# Altium schematic sheet Bank.SchDoc
size A3
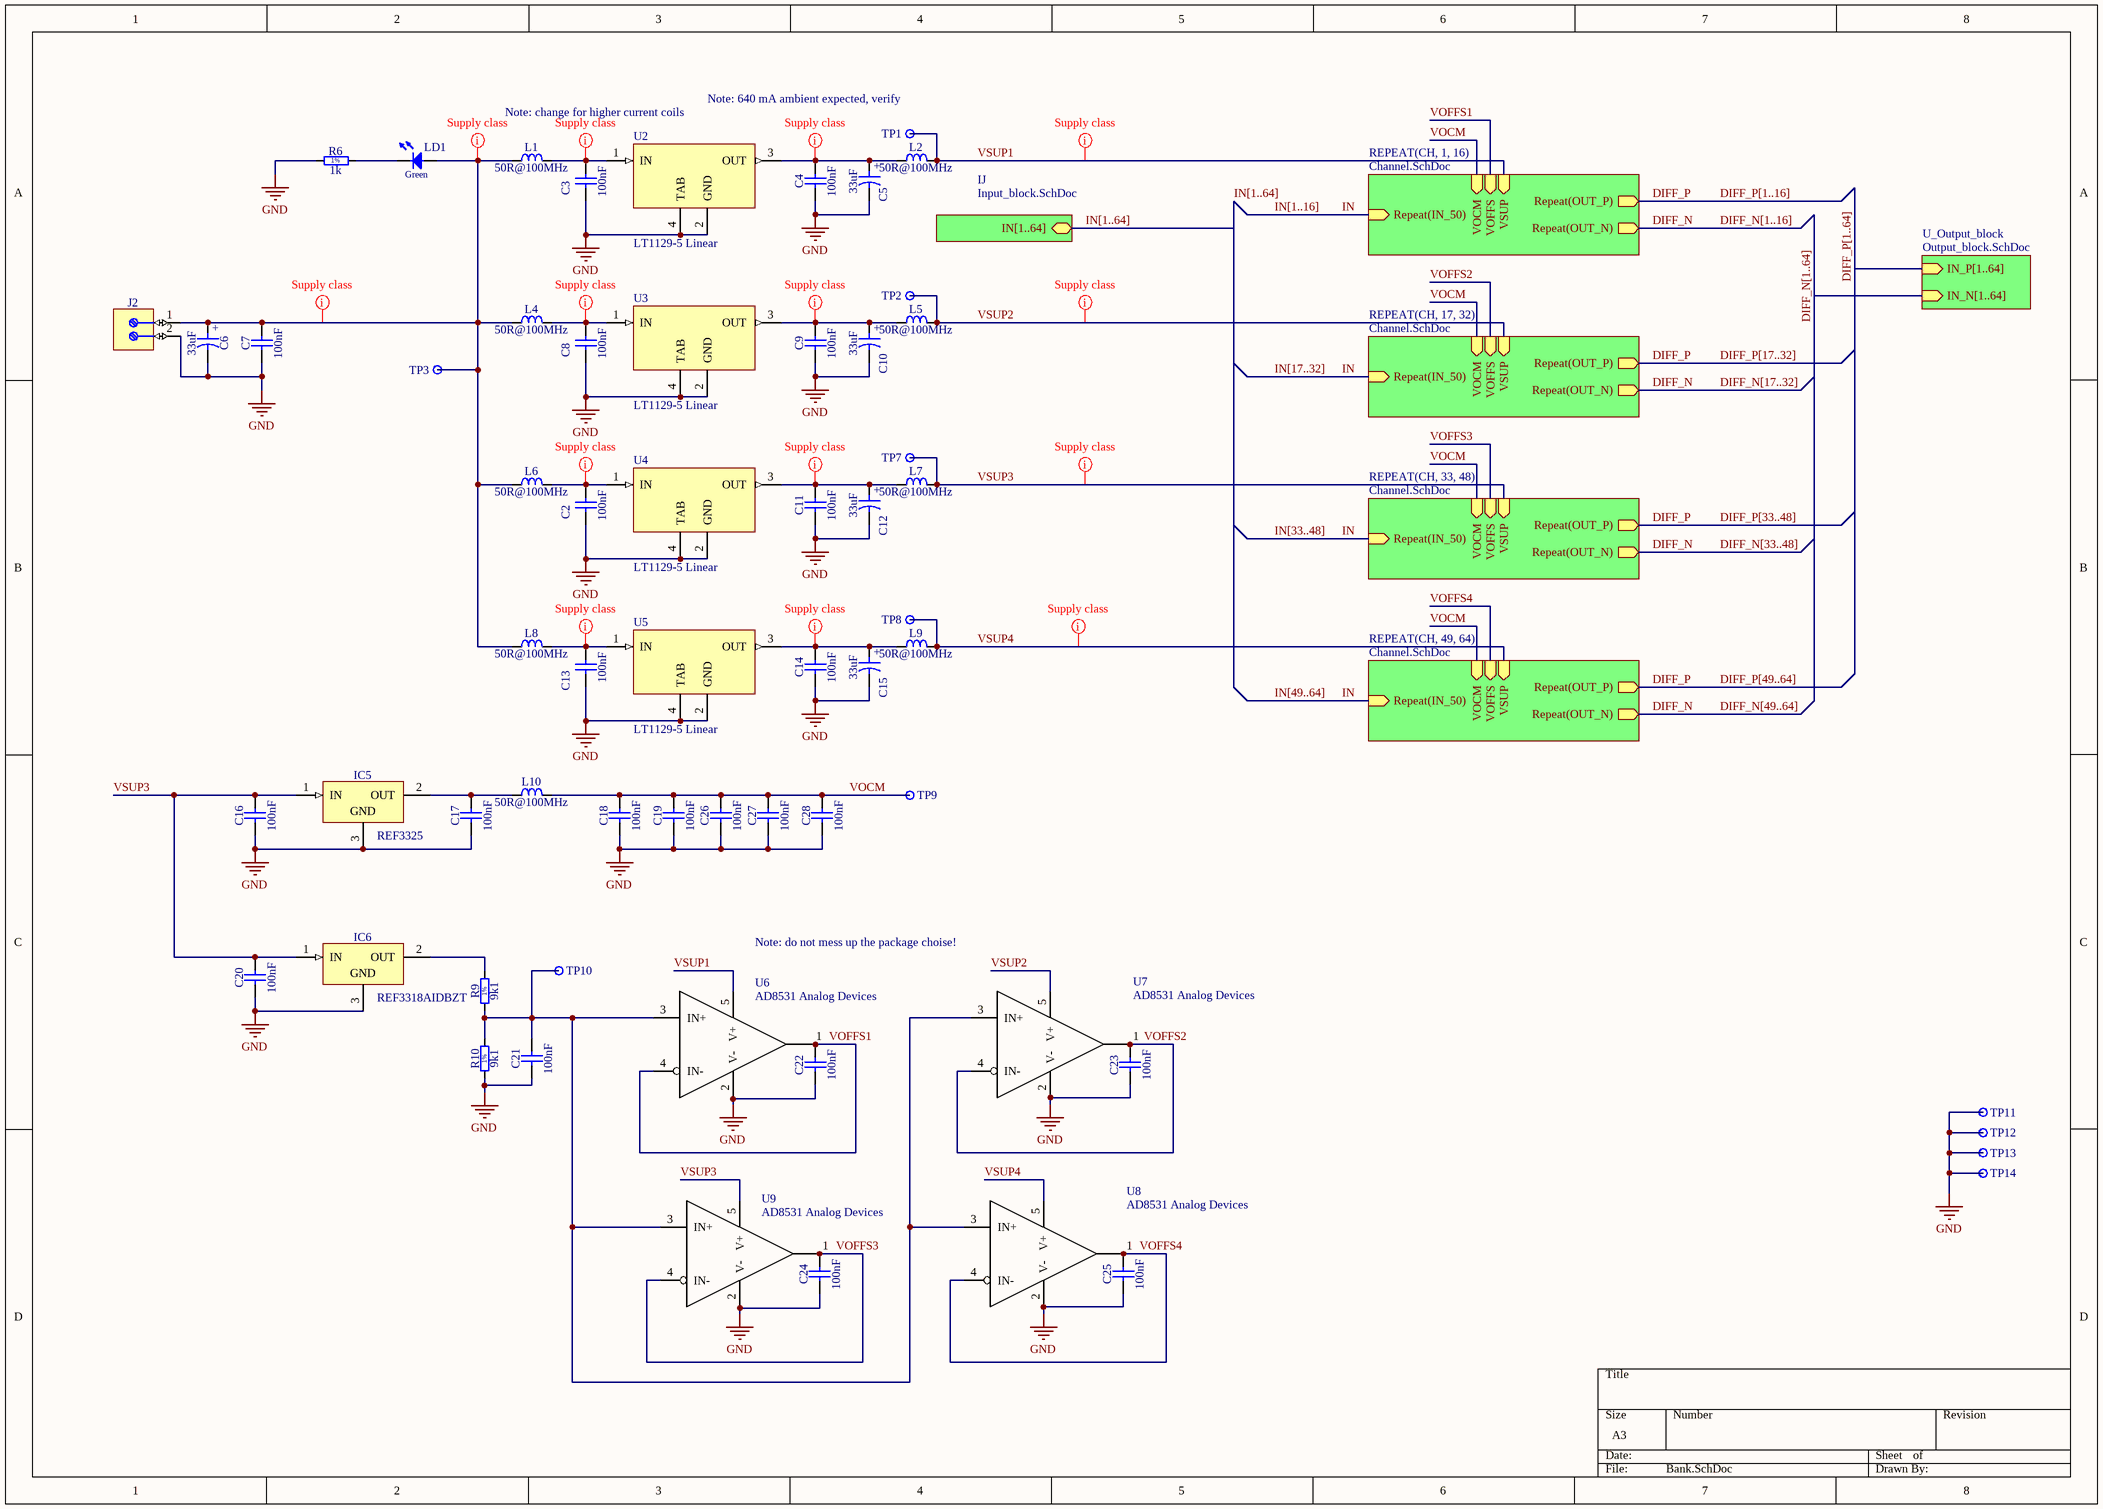
[diagram p0: Bank.SchDoc]

## Parts
C2  100nF  [CAPC2012X135N]
C3  100nF  [CAPC2012X135N]
C4  100nF  [CAPC2012X135N]
C5  33uF  [CAPAE660X540N]
C6  33uF  [CAPAE660X540N]
C7  100nF  [CAPC2012X135N]
C8  100nF  [CAPC2012X135N]
C9  100nF  [CAPC2012X135N]
C10  33uF  [CAPAE660X540N]
C11  100nF  [CAPC2012X135N]
C12  33uF  [CAPAE660X540N]
C13  100nF  [CAPC2012X135N]
C14  100nF  [CAPC2012X135N]
C15  33uF  [CAPAE660X540N]
C16  100nF  [CAPC2012X135N]
C17  100nF  [CAPC2012X135N]
C18  100nF  [CAPC2012X135N]
C19  100nF  [CAPC2012X135N]
C20  100nF  [CAPC2012X135N]
C21  100nF  [CAPC2012X135N]
C22  100nF  [CAPC2012X135N]
C23  100nF  [CAPC2012X135N]
C24  100nF  [CAPC2012X135N]
C25  100nF  [CAPC2012X135N]
C26  100nF  [CAPC2012X135N]
C27  100nF  [CAPC2012X135N]
C28  100nF  [CAPC2012X135N]
IC5  REF3325  [SOT95P237X112-3N]
IC6  REF3318AIDBZT  [SOT95P237X112-3N]
J2  Terminal  [WIELAND_25.161.0253.0]  (value not drawn)
L1  50R@100MHz  [IND_MURATA_BLM31PG]
L2  50R@100MHz  [IND_MURATA_BLM31PG]
L4  50R@100MHz  [IND_MURATA_BLM31PG]
L5  50R@100MHz  [IND_MURATA_BLM31PG]
L6  50R@100MHz  [IND_MURATA_BLM31PG]
L7  50R@100MHz  [IND_MURATA_BLM31PG]
L8  50R@100MHz  [IND_MURATA_BLM31PG]
L9  50R@100MHz  [IND_MURATA_BLM31PG]
L10  50R@100MHz  [IND_MURATA_BLM31PG]
LD1  Green  [LED_OSRAM_LGR971]  (value not drawn)
R6  1k  [RESC2012X60N]
R9  9k1  [RESC2012X60N]
R10  9k1  [RESC2012X60N]
TP1  Test Point  [VERO_20-313145]  (value not drawn)
TP2  Test Point  [VERO_20-313145]  (value not drawn)
TP3  Test Point  [VERO_20-313145]  (value not drawn)
TP7  Test Point  [VERO_20-313145]  (value not drawn)
TP8  Test Point  [VERO_20-313145]  (value not drawn)
TP9  Test Point  [VERO_20-313145]  (value not drawn)
TP10  Test Point  [VERO_20-313145]  (value not drawn)
TP11  Test Point  [VERO_20-313145]  (value not drawn)
TP12  Test Point  [VERO_20-313145]  (value not drawn)
TP13  Test Point  [VERO_20-313145]  (value not drawn)
TP14  Test Point  [VERO_20-313145]  (value not drawn)
U2  LT1129-5 Linear  [SOT230P700X175-4N]
U3  LT1129-5 Linear  [SOT230P700X175-4N]
U4  LT1129-5 Linear  [SOT230P700X175-4N]
U5  LT1129-5 Linear  [SOT230P700X175-4N]
U6  AD8531 Analog Devices  [SOT95P285X145-5N]
U7  AD8531 Analog Devices  [SOT95P285X145-5N]
U8  AD8531 Analog Devices  [SOT95P285X145-5N]
U9  AD8531 Analog Devices  [SOT95P285X145-5N]

## Sub-sheets
IJ = Input_block.SchDoc: IN[1..64] (bidir)
REPEAT(CH, 1, 16) = Channel.SchDoc: Repeat(OUT_N) (out), Repeat(OUT_P) (out), VSUP (in), Repeat(IN_50) (in), VOFFS (in), VOCM (in)
REPEAT(CH, 17, 32) = Channel.SchDoc: Repeat(OUT_N) (out), Repeat(OUT_P) (out), VSUP (in), Repeat(IN_50) (in), VOCM (in), VOFFS (in)
REPEAT(CH, 33, 48) = Channel.SchDoc: Repeat(OUT_N) (out), Repeat(OUT_P) (out), VSUP (in), Repeat(IN_50) (in), VOCM (in), VOFFS (in)
REPEAT(CH, 49, 64) = Channel.SchDoc: Repeat(OUT_N) (out), Repeat(OUT_P) (out), VSUP (in), Repeat(IN_50) (in), VOCM (in), VOFFS (in)
U_Output_block = Output_block.SchDoc: IN_P[1..64] (in), IN_N[1..64] (in)

## Nets
GND: C2.1 C3.1 C4.1 C5.2 C6.2 C7.1 C8.1 C9.1 C10.2 C11.1 C12.2 C13.1 C14.1 C15.2 C16.1 C17.1 C18.1 C19.1 C20.1 C21.1 C22.1 C23.1 C24.1 C25.1 C26.1 C27.1 C28.1 IC5.3(GND) IC6.3(GND) J2.2 R6.1 R10.1 TP11.1 TP12.1 TP13.1 TP14.1 U2.2(GND) U2.4(TAB) U3.2(GND) U3.4(TAB) U4.2(GND) U4.4(TAB) U5.2(GND) U5.4(TAB) U6.2(V-) U7.2(V-) U8.2(V-) U9.2(V-)
DIFF_N: sheet REPEAT(CH, 1, 16)/Repeat(OUT_N), sheet REPEAT(CH, 17, 32)/Repeat(OUT_N), sheet REPEAT(CH, 33, 48)/Repeat(OUT_N), sheet REPEAT(CH, 49, 64)/Repeat(OUT_N)
DIFF_P: sheet REPEAT(CH, 1, 16)/Repeat(OUT_P), sheet REPEAT(CH, 17, 32)/Repeat(OUT_P), sheet REPEAT(CH, 33, 48)/Repeat(OUT_P), sheet REPEAT(CH, 49, 64)/Repeat(OUT_P)
IN: sheet REPEAT(CH, 1, 16)/Repeat(IN_50), sheet REPEAT(CH, 17, 32)/Repeat(IN_50), sheet REPEAT(CH, 33, 48)/Repeat(IN_50), sheet REPEAT(CH, 49, 64)/Repeat(IN_50)
VOCM: C18.2 C19.2 C26.2 C27.2 C28.2 L10.2 TP9.1 ; sheet REPEAT(CH, 1, 16)/VOCM, sheet REPEAT(CH, 17, 32)/VOCM, sheet REPEAT(CH, 33, 48)/VOCM, sheet REPEAT(CH, 49, 64)/VOCM
VOFFS1: C22.2 U6.1(OUT+) U6.4(IN-) ; sheet REPEAT(CH, 1, 16)/VOFFS
VOFFS2: C23.2 U7.1(OUT+) U7.4(IN-) ; sheet REPEAT(CH, 17, 32)/VOFFS
VOFFS3: C24.2 U9.1(OUT+) U9.4(IN-) ; sheet REPEAT(CH, 33, 48)/VOFFS
VOFFS4: C25.2 U8.1(OUT+) U8.4(IN-) ; sheet REPEAT(CH, 49, 64)/VOFFS
VSUP1: L2.2 TP1.1 U6.5(V+) ; sheet REPEAT(CH, 1, 16)/VSUP
VSUP2: L5.2 TP2.1 U7.5(V+) ; sheet REPEAT(CH, 17, 32)/VSUP
VSUP3: C16.2 C20.2 IC5.1(IN) IC6.1(IN) L7.2 TP7.1 U9.5(V+) ; sheet REPEAT(CH, 33, 48)/VSUP
VSUP4: L9.2 TP8.1 U8.5(V+) ; sheet REPEAT(CH, 49, 64)/VSUP
NetC2_2: C2.2 L6.2 U4.1(IN)
NetC3_2: C3.2 L1.2 U2.1(IN)
NetC4_2: C4.2 C5.1 L2.1 U2.3(OUT)
NetC6_1: C6.1 C7.2 J2.1 L1.1 L4.1 L6.1 L8.1 LD1.2(A) TP3.1
NetC8_2: C8.2 L4.2 U3.1(IN)
NetC9_2: C9.2 C10.1 L5.1 U3.3(OUT)
NetC11_2: C11.2 C12.1 L7.1 U4.3(OUT)
NetC13_2: C13.2 L8.2 U5.1(IN)
NetC14_2: C14.2 C15.1 L9.1 U5.3(OUT)
NetC17_2: C17.2 IC5.2(OUT) L10.1
NetC21_2: C21.2 R9.1 R10.2 TP10.1 U6.3(IN+) U7.3(IN+) U8.3(IN+) U9.3(IN+)
NetIC6_2: IC6.2(OUT) R9.2
NetLD1_1: LD1.1(C) R6.2

## Buses and harness runs
bus DIFF_N[1..16]
bus DIFF_N[1..64] = sheet U_Output_block/IN_N[1..64]
bus DIFF_N[17..32]
bus DIFF_N[33..48]
bus DIFF_N[49..64]
bus DIFF_P[1..16]
bus DIFF_P[1..64] = sheet U_Output_block/IN_P[1..64]
bus DIFF_P[17..32]
bus DIFF_P[33..48]
bus DIFF_P[49..64]
bus IN[1..16]
bus IN[1..64] = sheet IJ/IN[1..64]
bus IN[17..32]
bus IN[33..48]
bus IN[49..64]

## Layout directives
net class Supply: NetC2_2, NetC3_2, NetC4_2, NetC6_1, NetC8_2, NetC9_2, NetC11_2, NetC13_2, NetC14_2, VSUP1, VSUP2, VSUP3, VSUP4

## Notes on the sheet
- (near TP1) Note: 640 mA ambient expected, verify
- Note: change for higher current coils
- Note: do not mess up the package choise!
- (in symbol CAE660-540_33UF_25V_20%) +
- (in symbol R0805_1K_1%_0.125W_100PPM) 1%
- (in symbol R0805_9K1_1%_0.125W_100PPM) 1%

## Library data of the parts
C2-C4 C7-C9 C11 C13 C14 C16-C28 = CC0805_100NF_50V_10%_X7R: Non-polarised capacitor; Part Description: SMD Multilayer Chip Ceramic Capacitor; Manufacturer: GENERIC; Manufacturer1 Part Number: C2012X7R1H104K085AA; Voltage: 50V; TC: X7R; Tolerance: ±10%; Part Number: CC0805_100NF_50V_10%_X7R; Component Kind: Standard; Component Type: Standard; Pin Count: 2; Value: 100nF; Status: Preferred; Manufacturer Part Number: CC0805_100NF_50V_10%_X7R; Case: 0805; Mounted: Yes; Socket: No; SMD: Yes; Sense: No; Manufacturer1 Example: TDK; Manufacturer1 ComponentHeight: 1mm; HelpURL: \\cern.ch\dfs\Applications\Altium\Datasheets\CC0805_X7R_TDK_C.pdf; Author: CERN DEM JLC; CreateDate: 03.12.2007; LatestRevisionDate: 22.04.2015
C5 C6 C10 C12 C15 = CAE660-540_33UF_25V_20%: Polarised capacitor; Part Description: Aluminum Electrolytic SMT Capacitor; Manufacturer: PANASONIC; Manufacturer Part Number: EEEFK1E330AP; Voltage: 25V; Tolerance: ±20%; Part Number: CAE660-540_33UF_25V_20%; Component Kind: Standard; Component Type: Standard; Pin Count: 2; Value: 33uF; Status: Not Recommended; Case: D; Mounted: Yes; Socket: No; SMD: Yes; Sense: No; ComponentHeight: 5.8mm; HelpURL: \\cern.ch\dfs\Applications\Altium\Datasheets\CAE_PANASONIC_FK.pdf; Author: CERN DEM JLC; CreateDate: 03.12.2007; LatestRevisionDate: 05.11.2014
IC5 IC6 = REF3318AIDBZT: 3-Terminal Regulator 1=IN 2=OUT 3=GND; Part Description: 1.8V, 30ppm/°C Drift, 3.9uA, Voltage Reference; Manufacturer: TEXAS INSTRUMENTS; PressFit: No; Bonding: No; Component Kind: Standard; Component Type: Standard; PackageDescription: SOT, 0.95mm, pitch; 3 pin,1.30mm W X 2.92mm L X 1.12mm H body, IPC Medium Density; Pin Count: 3; Case: SOT23; Mounted: Yes; Socket: No; SMD: Yes; Sense: No; ComponentHeight: 1.12mm; HelpURL: \\cern.ch\dfs\Applications\Altium\Datasheets\REF3318AIDBZT.pdf; Author: CERN DEM JLC; CreateDate: 20.06.2011; LatestRevisionDate: 20.06.2011
  IC5: Part Number: REF3325; Device: REF3325; Manufacturer Part Number: REF3325
  IC6: Part Number: REF3318AIDBZT; Device: REF3318AIDBZT; Manufacturer Part Number: REF3318AIDBZT
J2 = WIELAND_25.161.0253.0: Terminal Block, 2 Positions, Screw Connection; Part Description: 16A 250VAC 2 Way PCB Terminal Block, Pitch 5mm, Screw Connection, Wire Size Max: 2.5mm²; PressFit: No; Part Number: WIELAND_25.161.0253.0; Component Kind: Standard; Component Type: Standard; Pin Count: 3; Family: Terminal; Mounted: Yes; Socket: No; SMD: No; Sense: No; Status: None; Manufacturer: WIELAND; Manufacturer Part Number: 25.161.0253.0; ComponentHeight: 15mm; HelpURL: \\cern.ch\dfs\Applications\Altium\Datasheets\WIELAND_25.161.0253.0.pdf; Author: CERN DEM JLC; CreateDate: 03.06.2009; LatestRevisionDate: 03.06.2009
L1 L2 L4-L10 = IND1206_MURATA_BLM31PG500SN1: Inductor; Part Description: SMD EMIFIL Chip Ferrite Bead; Manufacturer: MURATA; Power: 3.5A; Resistance: 0.015R; Part Number: IND1206_MURATA_BLM31PG500SN1; Component Kind: Standard; Component Type: Standard; Pin Count: 2; Value: 50R@100MHz; Status: None; Manufacturer Part Number: BLM31PG500SN1; Case: 1206; Mounted: Yes; Socket: No; SMD: Yes; Sense: No; ComponentHeight: 1.3mm; HelpURL: \\cern.ch\dfs\Applications\Altium\Datasheets\IND1206_MURATA_BLM31P.pdf; Author: CERN DEM JLC; CreateDate: 05.12.2013; LatestRevisionDate: 05.12.2013
LD1 = LED_OSRAM_LGR971: LED Green 1C 2A; Part Description: Surface Mount Green LED (0805 Case); Manufacturer: OSRAM; Manufacturer Part Number: LGR971; PressFit: No; Bonding: No; Part Number: LED_OSRAM_LGR971; Component Kind: Standard; Component Type: Standard; Color: Green; PackageDescription: Green Chip LED, 2-Leads, Body 2.0x1.25mm, IPC Medium Density; Pin Count: 2; Case: 0805; Mounted: Yes; Socket: No; SMD: Yes; Sense: No; ComponentHeight: 0.9mm; HelpURL: \\cern.ch\dfs\Applications\Altium\Datasheets\LED_OSRAM_LGR971.pdf; Author: CERN DEM JLC; CreateDate: 28.01.2009; LatestRevisionDate: 17.03.2010
R6 = R0805_1K_1%_0.125W_100PPM: Resistor - 1%; Part Description: General Purpose Thick Film Chip Resistor; Manufacturer: GENERIC; Manufacturer1 Part Number: NRC10F1001TRF; Power: 0.125W; TC: ±100ppm/°C; PressFit: No; Part Number: R0805_1K_1%_0.125W_100PPM; Component Kind: Standard; Component Type: Standard; Pin Count: 2; Value: 1k; Status: Preferred; Tolerance: ±1%; Manufacturer Part Number: R0805_1K_1%_0.125W_100PPM; Case: 0805; Mounted: Yes; Sense: No; Socket: No; SMD: Yes; Manufacturer1 Example: NIC COMPONENT; Manufacturer1 ComponentHeight: 0.6mm; HelpURL: \\cern.ch\dfs\Applications\Altium\Datasheets\R0805_NIC_NRC.pdf; Author: CERN DEM JLC; CreateDate: 03.12.2007; LatestRevisionDate: 13.03.2008
R9 R10 = R0805_9K1_1%_0.125W_100PPM: Resistor - 1%; Part Description: General Purpose Thick Film Chip Resistor; Manufacturer: GENERIC; Manufacturer1 Part Number: NRC10F9101TRF; Power: 0.125W; TC: ±100ppm/°C; PressFit: No; Part Number: R0805_9K1_1%_0.125W_100PPM; Component Kind: Standard; Component Type: Standard; Pin Count: 2; Value: 9k1; Status: Preferred; Tolerance: ±1%; Manufacturer Part Number: R0805_9K1_1%_0.125W_100PPM; Case: 0805; Mounted: Yes; Sense: No; Socket: No; SMD: Yes; Manufacturer1 Example: NIC COMPONENT; Manufacturer1 ComponentHeight: 0.6mm; HelpURL: \\cern.ch\dfs\Applications\Altium\Datasheets\R0805_NIC_NRC.pdf; Author: CERN DEM JLC; CreateDate: 03.12.2007; LatestRevisionDate: 13.03.2008
TP1-TP3 TP7-TP14 = VERO_20-313145: Part Description: Black Bead PCB Terminal Test Pin for 2.4mm PCB Thickness (1.32mm Hole); Manufacturer: VERO TECHNOLOGIES; PressFit: No; Part Number: VERO_20-313145; Component Kind: Standard; Component Type: Standard; Pin Count: 1; Family: Test Point; Mounted: Yes; Socket: No; SMD: No; Sense: No; Status: None; Manufacturer Part Number: 20-313145; ComponentHeight: 5.3mm; HelpURL: \\cern.ch\dfs\Applications\Altium\Datasheets\VERO_20-313145.pdf; Author: CERN DEM JLC; CreateDate: 15.07.2013; LatestRevisionDate: 15.07.2013
U2-U5 = LT1129-5: Name: LT1129-5; Manufacturer: Linear
U6-U9 = AD8531: Manufacturer: Analog Devices; Name: AD8531